# Altium schematic sheet Cam.SchDoc
size Letter; SheetNumber: 2; SheetTotal: 5
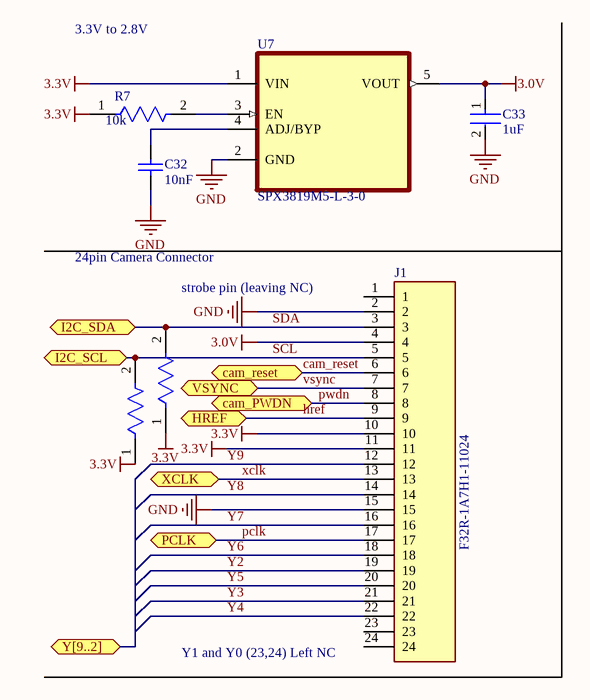
[diagram p0: Cam.SchDoc]

## Parts
C32  10nF  [CAPC2013X140X50LL20T25]
C33  1uF  [FP-RCE1K1-MFG]
J1  F32R-1A7H1-11024  [AMPHENOL_F32R-1A7H1-11024]
R7  10k  [FP-CPF0603-MFG]
R11  AC0603JR-7W10KL  [FP-AC0603-IPC_A]  (value not drawn)
R12  AC0603JR-7W10KL  [FP-AC0603-IPC_A]  (value not drawn)
U7  SPX3819M5-L-3-0  [SOT95P280X145-5N]

## Ports
cam_PWDN (bidir), cam_reset (bidir), HREF (bidir), I2C_SCL (bidir), I2C_SDA (bidir), PCLK (bidir), VSYNC (bidir), XCLK (bidir), Y[9..2] (bidir)

## Nets
3.0V: C33.1 J1.4 U7.5(VOUT)
3.3V: J1.10 J1.11 R7.1 R11.1 R12.1 U7.1(VIN)
GND: C32.2 C33.2 J1.2 J1.15 U7.2(GND)
cam_reset: J1.6 ; port cam_reset
href: J1.9 ; port HREF
pclk: J1.17 ; port PCLK
pwdn: J1.8 ; port cam_PWDN
SCL: J1.5 R11.2 ; port I2C_SCL
SDA: J1.3 R12.2 ; port I2C_SDA
vsync: J1.7 ; port VSYNC
xclk: J1.13 ; port XCLK
Y2: J1.19
Y3: J1.21
Y4: J1.22
Y5: J1.20
Y6: J1.18
Y7: J1.16
Y8: J1.14
Y9: J1.12
NetC32_1: C32.1 U7.4(ADJ/BYP)
NetR7_2: R7.2 U7.3(EN)

Not connected (* = marked no-connect by the designer): J1 1 23 24

## Notes on the sheet
- 3.3V to 2.8V
- 24pin Camera Connector
- strobe pin (leaving NC)
- (near J1) Y1 and Y0 (23,24) Left NC

## Library data of the parts
C32 = CMP-2007-04788-1: Part Number: 08055F103KAT2A; Manufacturer: AVX Interconnect / Elco
C33 = CMP-00260-148573931-1: RCEC72A105K1K1H03B; Capacitance: 1µF; Tolerance: 10%; Material: Ceramic; Voltage Rating: 100V; Min Operating Temperature: -55°C; Case/Package: Radial; Max Operating Temperature: 125°C; Lifecycle Status: Production; Height: 5mm
J1 = CMP-002-00071-1: Flex Connector, 0.50mm Pitch, Height 2.00mm, Right angle, Slider type, ZIF, Bottom contact, 24 position , Without MYLAR; MF: Amphenol ICC / Aorora; Check_prices: https://www.snapeda.com/parts/F32R-1A7H1-11024/Amphenol/view-part/?ref=eda; Design Item ID: F32R-1A7H1-11024; SnapEDA_Link: https://www.snapeda.com/parts/F32R-1A7H1-11024/Amphenol/view-part/?ref=snap; Source: F32R-1A7H1-11024.SchLib; Pins: 24; Case/Package: None; MP: F32R-1A7H1-11024; Component Type: Standard; Value: *
R7 = CMP-03211-003506-1: RES SMD 10KΩ 0.5% 1/16W 0603; Manufacturer: TE Connectivity; Manufacturer Part Number: CPF0603D10KE; Power Rating: 0.063W; Temperature Coefficient: 25ppm/°C; Voltage Rating: 50V; ComponentLink2Description: Datasheet; packaging: 5k Reel; Automotive: No; Octopart: https://octopart.com/cpf0603d10ke-te+connectivity-22737789; Composition: Thin Film; Value: 10KΩ; Category: Res; RoHS: TRUE; Height: 0.55mm; Lead Free: Yes; ComponentLink2URL: https://www.te.com/commerce/DocumentDelivery/DDEController?Action=showdoc&DocId=Data+Sheet%7F1773200%7FM%7Fpdf%7FEnglish%7FENG_DS_1773200_M.pdf%7F3-1676481-2; Temperature: -55°C to +155°C; Device Class L3: Chip SMD Resistors; Device Class L1: Passive Components; octopart_url: https://octopart.com/cpf0603d10ke-te+connectivity-22737789; Tolerance: 0.5%; Resistance: 10KΩ; Package: CPF0603; Temperature Range High: +155°C; Series: CPF; Temperature Range Low: -55°C; Device Class L2: Resistors; Ipc Land Pattern Name: RESC15580X45
R11 R12 = CMP-03412-040683-1: RES 10kΩ 5.00% 0.2W 0603
U7 = CMP-031-00008-1: Linear Voltage Regulator IC Positive Fixed 1 Output 500mA SOT-23-5; MF: MaxLinear, Inc.; Pins: 5; MP: SPX3819M5-L-3-0; Source: SPX3819M5-L-3-0.SchLib; Case/Package: SOT-23-5 Exar; Check_prices: https://www.snapeda.com/parts/SPX3819M5-L-3-0/MaxLinear/view-part/?ref=eda; Design Item ID: SPX3819M5-L-3-0; SnapEDA_Link: https://www.snapeda.com/parts/SPX3819M5-L-3-0/MaxLinear/view-part/?ref=snap; Component Type: Standard; Value: *